# Altium schematic sheet AVD_eFuse_LV_Supply.SchDoc: GEM AVD eFuse
size 420 x 297 mm; Author: G.Kasprowicz; CompanyName: WUT ISE; DrawnBy: G.Kasprowicz; Organization: WUT ISE; Address1: PW ISE; Address2: Nowowiejska 15/19 00-665 Warsaw; Address3: gkasprow@gmail.com; Revision: 2; SheetNumber: 4; SheetTotal: 6; ModifiedBy: -; CheckedDate: -; Title2: LV supply; DivGrp: WUT ISE; Designer: G.Kasprowicz; ModifiedDate: -; ProjectName: Sensor Box
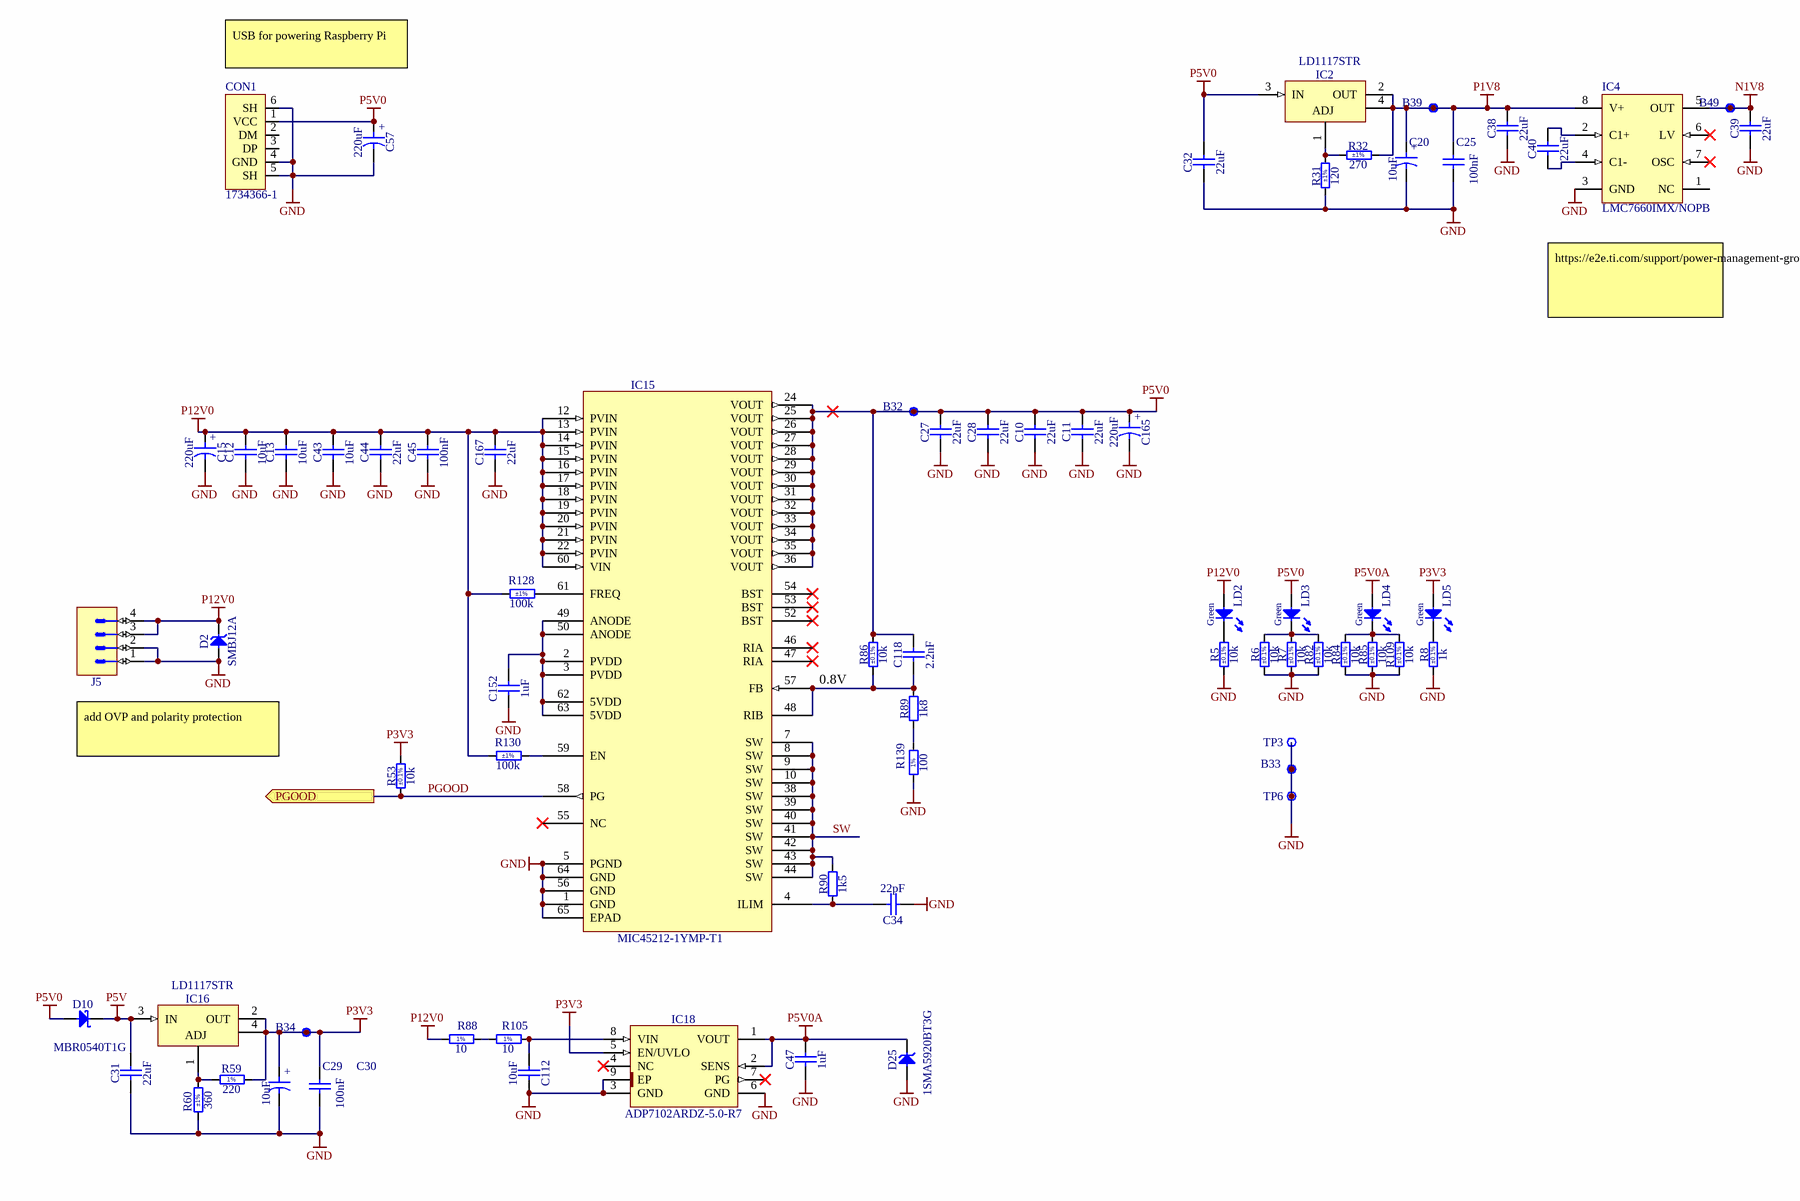
[diagram p0: AVD_eFuse_LV_Supply.SchDoc]

## Parts
B32  SMD Pad  [C100]  (value not drawn)
B33  SMD Pad  [C100]  (value not drawn)
B34  SMD Pad  [C100]  (value not drawn)
B39  SMD Pad  [C100]  (value not drawn)
B49  SMD Pad  [C100]  (value not drawn)
C10  22uF  [CAPC2012X135N]
C11  22uF  [CAPC2012X135N]
C12  10uF  [CAPC2012X135N]
C13  10uF  [CAPC2012X135N]
C15  220uF  [CAPMP7343X430N]
C20  10uF  [CAPAE430X540N]
C25  100nF  [CAPC1608X87N]
C27  22uF  [CAPC2012X135N]
C28  22uF  [CAPC2012X135N]
C29  10uF  [CAPAE430X540N]
C30  100nF  [CAPC1608X87N]
C31  22uF  [CAPC2012X135N]
C32  22uF  [CAPC2012X135N]
C34  22pF  [CAPC1005X55N]
C38  22uF  [CAPC2012X135N]
C39  22uF  [CAPC2012X135N]
C40  22uF  [CAPC2012X135N]
C43  10uF  [CAPC2012X135N]
C44  22uF  [CAPC2012X135N]
C45  100nF  [CAPC1608X87N]
C47  1uF  [CAPC1608X87N]
C57  220uF  [CAPMP7343X430N]
C112  10uF  [CAPC2012X135N]
C118  2.2nF  [CAPC1608X87N]
C152  1uF  [CAPC1608X87N]
C165  220uF  [CAPMP7343X430N]
C167  22uF  [CAPC2012X135N]
CON1  1734366-1  [1734366-1]
D2  SMBJ12A  [DIOM5336X265N]
D10  MBR0540T1G  [SOD3716X135N]
D25  1SMA5920BT3G  [DIOM5226X220N]
IC2  LD1117STR  [SOT230P700X180-4N]
IC4  LMC7660IMX/NOPB  [D0008A_L]
IC15  MIC45212-1YMP-T1  [MICROCHIP_QFN64_12X12]
IC16  LD1117STR  [SOT230P700X180-4N]
IC18  ADP7102ARDZ-5.0-R7  [SOIC127P600X175-9N-R241X309]
J5  Mini-Fit Jr.™  [MOLEX_39-30-0040]  (value not drawn)
LD2  Green  [LED_KINGBRIGHT_KP-1608CGCK]
LD3  Green  [LED_KINGBRIGHT_KP-1608CGCK]
LD4  Green  [LED_KINGBRIGHT_KP-1608CGCK]
LD5  Green  [LED_KINGBRIGHT_KP-1608CGCK]
R5  10k  Tolerance: ±0.1%  [RESC1608X64N]
R6  10k  Tolerance: ±0.1%  [RESC1608X64N]
R7  10k  Tolerance: ±0.1%  [RESC1608X64N]
R8  1k  Tolerance: ±0.1%  [RESC1608X55N]
R31  120  Tolerance: ±1%  [RESC1005X40N]
R32  270  Tolerance: ±1%  [RESC1005X40N]
R53  10k  Tolerance: ±0.1%  [RESC1608X64N]
R59  220  [RESC1005X40N]
R60  360  Tolerance: ±1%  [RESC1608X55N]
R82  10k  Tolerance: ±0.1%  [RESC1608X64N]
R84  10k  Tolerance: ±0.1%  [RESC1608X64N]
R85  10k  Tolerance: ±0.1%  [RESC1608X64N]
R86  10k  Tolerance: ±0.1%  [RESC1608X64N]
R88  10  [RESC2012X60N]
R89  1k8  [RESC1608X55N]
R90  1k5  [RESC1005X40N]
R105  10  [RESC2012X60N]
R109  10k  Tolerance: ±0.1%  [RESC1608X64N]
R128  100k  Tolerance: ±1%  [RESC1608X55N]
R130  100k  Tolerance: ±1%  [RESC1608X55N]
R139  100  [RESC1005X40N]
TP3  (no value)  [TYCO_RCT-0C]
TP6  (no value)  [TYCO_RCT-0C]

## Ports
PGOOD (out, see GEM_AVD_eFuse[2B], AVD_eFuse_HV_Ctrl[4E])

## Nets
GND: B33.1 C10.1 C11.1 C12.1 C13.1 C15.2 C20.2 C25.1 C27.1 C28.1 C29.2 C30.1 C31.1 C32.1 C34.1 C38.1 C39.1 C43.1 C44.1 C45.1 C47.1 C57.2 C112.2 C152.1 C165.2 C167.1 CON1.4(GND) CON1.5(SH) CON1.6(SH) D2.2(A) D25.2(A) IC4.3(GND) IC15.1(GND) IC15.5(PGND) IC15.56(GND) IC15.64(GND) IC15.65(EPAD) IC18.3(GND) IC18.6(GND) IC18.9(EP) J5.1 J5.2 R5.1 R6.1 R7.1 R8.1 R31.1 R60.1 R82.1 R84.1 R85.1 R109.1 R139.1 TP3.1 TP6.1
N1V8: B49.1 C39.2 IC4.5(OUT)
P1V8: B39.1 C20.1 C25.2 C38.2 IC2.2(OUT) IC2.4(OUT) IC4.8(V+) R32.2
P3V3: B34.1 C29.1 C30.2 IC16.2(OUT) IC16.4(OUT) IC18.5(EN/UVLO) LD5.2(A) R53.2 R59.2
P5V: C31.2 D10.1(C) IC16.3(IN)
P5V0: B32.1 C10.2 C11.2 C27.2 C28.2 C32.2 C57.1 C118.2 C165.1 CON1.1(VCC) D10.2(A) IC2.3(IN) IC15.24(VOUT) IC15.25(VOUT) IC15.26(VOUT) IC15.27(VOUT) IC15.28(VOUT) IC15.29(VOUT) IC15.30(VOUT) IC15.31(VOUT) IC15.32(VOUT) IC15.33(VOUT) IC15.34(VOUT) IC15.35(VOUT) IC15.36(VOUT) LD3.2(A) R86.2
P5V0A: C47.2 D25.1(C) IC18.1(VOUT) IC18.2(SENS) LD4.2(A)
P12V0: C12.2 C13.2 C15.1 C43.2 C44.2 C45.2 C167.2 D2.1(C) IC15.12(PVIN) IC15.13(PVIN) IC15.14(PVIN) IC15.15(PVIN) IC15.16(PVIN) IC15.17(PVIN) IC15.18(PVIN) IC15.19(PVIN) IC15.20(PVIN) IC15.21(PVIN) IC15.22(PVIN) IC15.60(VIN) J5.3 J5.4 LD2.2(A) R88.1 R128.1 R130.1
PGOOD: IC15.58(PG) R53.1 ; port PGOOD
SW: IC15.7(SW) IC15.8(SW) IC15.9(SW) IC15.10(SW) IC15.38(SW) IC15.39(SW) IC15.40(SW) IC15.41(SW) IC15.42(SW) IC15.43(SW) IC15.44(SW) R90.2
NetC34_2: C34.2 IC15.4(ILIM) R90.1
NetC40_1: C40.1 IC4.4(C1-)
NetC40_2: C40.2 IC4.2(C1+)
NetC112_1: C112.1 IC18.8(VIN) R105.2
NetC118_1: C118.1 IC15.48(RIB) IC15.57(FB) R86.1 R89.2
NetC152_2: C152.2 IC15.2(PVDD) IC15.3(PVDD) IC15.49(ANODE) IC15.50(ANODE) IC15.62(5VDD) IC15.63(5VDD)
NetIC2_1: IC2.1(ADJ) R31.2 R32.1
NetIC15_59: IC15.59(EN) R130.2
NetIC15_61: IC15.61(FREQ) R128.2
NetIC16_1: IC16.1(ADJ) R59.1 R60.2
NetLD2_1: LD2.1(C) R5.2
NetLD3_1: LD3.1(C) R6.2 R7.2 R82.2
NetLD4_1: LD4.1(C) R84.2 R85.2 R109.2
NetLD5_1: LD5.1(C) R8.2
NetR88_2: R88.2 R105.1
NetR89_1: R89.1 R139.2

Not connected (* = marked no-connect by the designer): CON1 2(DM) 3(DP); IC4 1(NC) 6(LV)* 7(OSC)*; IC15 46(RIA)* 47(RIA)* 52(BST)* 53(BST)* 54(BST)* 55(NC)*; IC18 4(NC)* 7(PG)*

## Notes on the sheet
- (near CON1) USB for powering Raspberry Pi
- https://e2e.ti.com/support/power-management-group/power-management/f/power-management-forum/934737/lmc7660-ceramic-capacitor?tisearch=e2e-sitesearch&keymatch=lmc7660#
- (near R86) 0.8V
- add OVP and polarity protection
- Project/Equipment
- Document
- Designer
- Drawn by
- Check.by
- Copyright WUT ISE 2020.
  This documentation describes Open Hardware and is licensed under the CERN OHL v.1.2. You may redistribute and modify this documentation under the terms of the CERN OHL v.1.2. (http://ohwr.org/CERNOHL). This documentation is distributed WITHOUT ANY EXPRESS OR IMPLIED WARRANTY, INCLUDING OF MERCHANTABILITY, SATISFACTORY QUALITY AND FITNESS FOR A PARTICULAR PURPOSE. Please see the CERN OHL v.1.2 for applicable conditions.
- Contact
- File
- Last Mod.
- Print Date
- Sheet
- Size
- A3
- of
- Rev
- (in symbol CAE430-540_10UF_16V_20%) +
- (in symbol CTE7343-43_220UF_16V_10%) +
- (in symbol R0402_100R_1%_0.0625W_100PPM) 1%
- (in symbol R0402_220R_1%_0.0625W_100PPM) 1%
- (in symbol R0805_10R_1%_0.125W_200PPM) 1%

## Library data of the parts
B32-B34 B39 B49 = SMD_PAD_D1MM: Pad; Part Description: 1mm Diameter SMD Pad; Mounted: No; Part Number: SMD_PAD_D1MM; Component Kind: Standard (No BOM); Component Type: Standard (No BOM); Pin Count: 1; Family: SMD Pad; Socket: No; SMD: Yes; Sense: No; Status: None; ComponentHeight: 0mm; HelpURL: Undefined; Author: CERN DEM JLC; CreateDate: 10.10.2017; LatestRevisionDate: 10.10.2017; PackageDescription: 1mm Diameter SMD Pad
C10 C11 C27 C28 C31 C32 C38-C40 C44 C167 = CC0805_22UF_16V_10%_X5R: Non-polarised capacitor; Part Description: SMD Multilayer Chip Ceramic Capacitor; Manufacturer: GENERIC; Manufacturer1 Part Number: C2012X5R1C226KT; Voltage: 16V; TC: X5R; Tolerance: ±10%; Part Number: CC0805_22UF_16V_10%_X5R; Component Kind: Standard; Component Type: Standard; Pin Count: 2; Value: 22uF; Status: Preferred; Manufacturer Part Number: CC0805_22UF_16V_10%_X5R; Case: 0805; Mounted: Yes; Socket: No; SMD: Yes; Sense: No; Manufacturer1 Example: TDK; Manufacturer1 ComponentHeight: 1.35mm; HelpURL: \\cern.ch\dfs\Applications\Altium\Datasheets\CC0805_X5R_TDK_C.pdf; Author: CERN DEM JLC; CreateDate: 25.10.2012; LatestRevisionDate: 25.10.2012
C12 C13 C43 C112 = CC0805_10UF_16V_10%_X5R: Non-polarised capacitor; Part Description: SMD Multilayer Chip Ceramic Capacitor; Manufacturer: GENERIC; Manufacturer1 Part Number: C0805C106K4PAC; Voltage: 16V; TC: X5R; Tolerance: ±10%; Part Number: CC0805_10UF_16V_10%_X5R; Component Kind: Standard; Component Type: Standard; Pin Count: 2; Value: 10uF; Status: Preferred; Manufacturer Part Number: CC0805_10UF_16V_10%_X5R; Case: 0805; Mounted: Yes; Socket: No; SMD: Yes; Manufacturer1 Example: KEMET; Manufacturer1 ComponentHeight: 1.4mm; HelpURL: \\cern.ch\dfs\Applications\Altium\Datasheets\CC1206_X5R_KEMET.pdf; Author: CERN DEM JLC; CreateDate: 03.12.2007; LatestRevisionDate: 03.12.2007; Sense: No
C15 C57 C165 = CTE7343-43_220UF_16V_10%: Polarised capacitor; Part Description: Solid Tantalum Chip Capacitor; Manufacturer: GENERIC; Manufacturer1 Part Number: TAJE227K016R; Voltage: 16V; Tolerance: ±10%; Part Number: CTE7343-43_220UF_16V_10%; Component Kind: Standard; Component Type: Standard; Pin Count: 2; Value: 220uF; Status: Preferred; Manufacturer Part Number: CTE7343-43_220UF_16V_10%; Case: E; Mounted: Yes; Socket: No; SMD: Yes; Sense: No; Manufacturer1 Example: AVX; Manufacturer1 ComponentHeight: 4.3mm; HelpURL: \\cern.ch\dfs\Applications\Altium\Datasheets\CTE_AVX_TAJ.pdf; Author: CERN DEM JLC; CreateDate: 03.12.2007; LatestRevisionDate: 03.12.2007
C20 C29 = CAE430-540_10UF_16V_20%: Polarised capacitor; Part Description: Aluminum Electrolytic SMT Capacitor; Manufacturer: PANASONIC; Manufacturer Part Number: EEEFK1C100AR; Voltage: 16V; Tolerance: ±20%; Part Number: CAE430-540_10UF_16V_20%; Component Kind: Standard; Component Type: Standard; Pin Count: 2; Value: 10uF; Status: Not Recommended; Case: B; Mounted: Yes; Socket: No; SMD: Yes; Sense: No; ComponentHeight: 5.8mm; HelpURL: \\cern.ch\dfs\Applications\Altium\Datasheets\CAE_PANASONIC_FK-V.pdf; Author: CERN DEM JLC; CreateDate: 03.12.2007; LatestRevisionDate: 05.11.2014
C25 C30 C45 = CC0603_100NF_50V_10%_X5R: Non-polarised capacitor; Part Description: SMD Multilayer Chip Ceramic Capacitor; Manufacturer: GENERIC; Manufacturer1 Part Number: C1608X5R1H104K080; Voltage: 50V; TC: X5R; Tolerance: ±10%; Part Number: CC0603_100NF_50V_10%_X5R; Component Kind: Standard; Component Type: Standard; Pin Count: 2; Value: 100nF; Status: None; Manufacturer Part Number: CC0603_100NF_50V_10%_X5R; Case: 0603; Mounted: Yes; Socket: No; SMD: Yes; Sense: No; Manufacturer1 Example: TDK; Manufacturer1 ComponentHeight: 0.9mm; HelpURL: \\cern.ch\dfs\Applications\Altium\Datasheets\CC0603_X5R_TDK_C.pdf; Author: CERN DEM MR; CreateDate: 08.01.2016; LatestRevisionDate: 08.01.2016
C34 = CC0402_22PF_50V_5%_C0G: Non-polarised capacitor; Part Description: SMD Multilayer Chip Ceramic Capacitor; Manufacturer: GENERIC; Manufacturer1 Part Number: C0402C220J5GACTU; Voltage: 50V; TC: C0G/NP0; Tolerance: ±5%; Part Number: CC0402_22PF_50V_5%_C0G; Component Kind: Standard; Component Type: Standard; Pin Count: 2; Value: 22pF; Status: Preferred; Manufacturer Part Number: CC0402_22PF_50V_5%_C0G; Case: 0402; Mounted: Yes; Socket: No; SMD: Yes; Sense: No; Manufacturer1 Example: KEMET; Manufacturer1 ComponentHeight: 0.55mm; HelpURL: \\cern.ch\dfs\Applications\Altium\Datasheets\CC0402_C0G_KEMET_(Commercial Grade).pdf; Author: CERN DEM JLC; CreateDate: 03.12.2007; LatestRevisionDate: 03.12.2007
C47 C152 = CC0603_1UF_25V_10%_X7R: Non-polarised capacitor; Part Description: SMD Multilayer Chip Ceramic Capacitor; Manufacturer: GENERIC; Manufacturer1 Part Number: GRM188R71E105KA12D; Voltage: 25V; TC: X7R; Tolerance: ±10%; Part Number: CC0603_1UF_25V_10%_X7R; Component Kind: Standard; Component Type: Standard; Pin Count: 2; Value: 1uF; Status: None; Manufacturer Part Number: CC0603_1UF_25V_10%_X7R; Case: 0603; Mounted: Yes; Socket: No; SMD: Yes; Sense: No; Manufacturer1 Example: MURATA; Manufacturer1 ComponentHeight: 0.9mm; HelpURL: \\cern.ch\dfs\Applications\Altium\Datasheets\CC0603_X7R_MURATA.pdf; Author: CERN DEM JLC; CreateDate: 18/01/2011; LatestRevisionDate: 18/01/2011
C118 = CC0603_2.2NF_50V_5%_C0G: Non-polarised capacitor; Part Description: SMD Multilayer Chip Ceramic Capacitor; Manufacturer: GENERIC; Manufacturer1 Part Number: C1608C0G1H222J080AA; Voltage: 50V; TC: C0G/NP0; Tolerance: ±5%; Part Number: CC0603_2.2NF_50V_5%_C0G; Component Kind: Standard; Component Type: Standard; Pin Count: 2; Value: 2.2nF; Status: Preferred; Manufacturer Part Number: CC0603_2.2NF_50V_5%_C0G; Case: 0603; Mounted: Yes; Socket: No; SMD: Yes; Sense: No; Manufacturer1 Example: TDK; Manufacturer1 ComponentHeight: 0.9mm; HelpURL: \\cern.ch\dfs\Applications\Altium\Datasheets\CC0603_C0G_TDK_C.pdf; Author: CERN DEM JMW; CreateDate: 23.06.2014; LatestRevisionDate: 23.06.2014
CON1 = CON_USB_A_Vertical: USB connector A type; Manufacturer Part Number: 1734366-1
D2 = SMBJ12A: Zener Diode; Part Description: Uni-Directional Transient Voltage Suppressor Diode; Manufacturer: FAIRCHILD SEMICONDUCTOR; Voltage: 12V; Power: 600W; PressFit: No; Bonding: No; Part Number: SMBJ12A; Component Kind: Standard; Component Type: Standard; Device: SMBJ12A; PackageDescription: DO-214-AA/SMB Diode, Molded Body; 5.34mm L X 3.625mm W X 2.65mm H, IPC Medium Density; Manufacturer Part Number: SMBJ12A; Pin Count: 2; Case: DO-214AA; Mounted: Yes; Socket: No; SMD: Yes; Sense: No; ComponentHeight: 2.65mm; HelpURL: \\cern.ch\dfs\Applications\Altium\Datasheets\SMBJ.pdf; Author: CERN DEM JLC; CreateDate: 10.04.2013; LatestRevisionDate: 10.04.2013
D10 = MBR0540T1G: Schottky Diode; Part Description: Schottky Power Rectifier; Manufacturer: ON SEMICONDUCTOR; Voltage: 40V; Power: 500mA; PressFit: No; Bonding: No; Part Number: MBR0540T1G; Component Kind: Standard; Component Type: Standard; Device: MBR0540T1G; PackageDescription: Diode (SOD-123), 2.70mm W X 1.60mm L X 1.35mm H body, IPC Medium Density; Manufacturer Part Number: MBR0540; Pin Count: 2; Case: SOD-123; Mounted: Yes; Socket: No; SMD: Yes; Sense: No; ComponentHeight: 1.35mm; HelpURL: \\cern.ch\dfs\Applications\Altium\Datasheets\MBR0540T1G.pdf; Author: CERN DEM JLC; CreateDate: 11.04.2011; LatestRevisionDate: 24.05.2022
D25 = D_Zener_1SMA5920BT3G: 6.2V 1.5 Watt Plastic Surface Mount Zener Voltage Regulators; Manufacturer: ON SEMICONDUCTOR; Power: 1.5W; PressFit: No; Bonding: No; Part Number: 1SMA5920BT3G; Component Kind: Standard; Component Type: Standard; Device: 1SMA5920BT3G; PackageDescription: DO-214-AC/SMA Diode, Molded Body; 5.21mm L X 2.60mm W X 2.20mm H, IPC Medium Density; Voltage: 6.2V; Part Description: Zener Voltage Regulators; Manufacturer Part Number: 1SMA5920BT3G; Pin Count: 2; Case: DO-214AC; Mounted: Yes; Socket: No; SMD: Yes; Sense: No; ComponentHeight: 2.20mm; HelpURL: \\cern.ch\dfs\Applications\Altium\Datasheets\1SMA5913BT3G.pdf; Author: GK; CreateDate: 16/02/2018; LatestRevisionDate: 16/02/2018
IC2 IC16 = LD1117STR: 3-Terminal Regulator 1=Adj 2=OUT 3=IN 4=OUT; Part Description: 1.25V To 15V Adjustable, 800mA Low-Dropout Positive Voltage Regulator; Manufacturer: ST MICROELECTRONICS; PressFit: No; Bonding: No; Part Number: LD1117STR; Component Kind: Standard; Component Type: Standard; Device: LD1117STR; PackageDescription: SOT223, 2.30mm Pitch; 4 Pin, 3.70mm W X 6.70mm L X 1.80mm H body, IPC Medium Density; Manufacturer Part Number: LD1117STR; Pin Count: 4; Case: SOT223; Mounted: Yes; Socket: No; SMD: Yes; Sense: No; ComponentHeight: 1.8mm; HelpURL: \\cern.ch\dfs\Applications\Altium\Datasheets\LD1117STR.pdf; Author: CERN DEM MR; CreateDate: 14.07.2016; LatestRevisionDate: 14.07.2016
IC4 = CMP-0065-00034-3: Switched Capacitor Voltage Converter, 8-pin Narrow SOIC, Pb-Free; Manufacturer: Texas Instruments; PowerWise: N; CompType: Switch Caps; PackageTopMarking: NSZXTT*LMC76*60IM; Code_IPC: SOIC127P600-8; Code_JEDEC: MS-012-AA; PackageReference: D0008A; RoHS: Y; ComponentLink1URL: http://www.ti.com/general/docs/lit/getliterature.tsp?genericPartNumber=LMC7660&fileType=pdf; PinCount: 8; PackageDescription: SOIC Narrow, 4.9 x 3.9 x 1.45mm, 8 Lead, 1.27mm Pitch; ComponentLink1Description: Datasheet URL; Manufacturer Part Number: LMC7660IMX/NOPB
IC15 = PM_MIC45212-1: 0.8V to 85% PVIN (4.5...26V), 14A Synchronous Step-Down Regulator Module; Manufacturer: MICROCHIP TECHNOLOGY; PressFit: No; Bonding: No; Part Number: MIC45212-1YMP-T1; Component Kind: Standard; Component Type: Standard; Device: MIC45212-1YMP-T1; PackageDescription: MICROCHIP_QFN64_12X12; Part Description: 0.8V to 85% PVIN (4.5...26V), 14A Synchronous Step-Down Regulator Module; Manufacturer Part Number: MIC45212-1YMP-T1; Pin Count: 64; Mounted: Yes; Socket: No; SMD: Yes; Sense: No; ComponentHeight: 3mm; HelpURL: \\cern.ch\dfs\Applications\Altium\Datasheets\MIC45116-1YMP.pdf; Author: GK; CreateDate: 15.08.2016; LatestRevisionDate: 15.08.2016
IC18 = ADP7102ARDZ-5.0-R7: 300 mA, Low Noise, CMOS LDO Linear Regulator; Part Description: 5V, 300mA, Low Noise, CMOS LDO Linear Regulator; Manufacturer: ANALOG DEVICES; PressFit: No; Bonding: No; Part Number: ADP7102ARDZ-5.0-R7; Component Kind: Standard; Component Type: Standard; Device: ADP7102ARDZ-5.0-R7; PackageDescription: SOIC 8, Pitch 1.27mm - Body 3.9x4.9mm, (w/thermal tab 2.41mm X 3.098mm), IPC Medium Density; Manufacturer Part Number: ADP7102ARDZ-5.0-R7; Pin Count: 8; Case: SOIC8; Mounted: Yes; Socket: No; SMD: Yes; Sense: No; ComponentHeight: 1.75mm; HelpURL: \\cern.ch\dfs\Applications\Altium\Datasheets\ADP7102ARDZ-5.0-R7.pdf; Author: CERN DEM JLC; CreateDate: 17.03.2014; LatestRevisionDate: 17.03.2014
J5 = MOLEX_39-30-0040: Connector 4 Male; Part Description: 4.20mm (.165") Pitch Mini-Fit Jr. Header, Dual Row, Right Angle with Snap-in Plastic Peg PCB Lock, 4 Circuits; Manufacturer: MOLEX; PressFit: No; Part Number: MOLEX_39-30-0040; Component Kind: Standard; Component Type: Standard; Pin Count: 4; Family: Mini-Fit Jr.™; Mounted: Yes; Socket: No; SMD: No; Sense: No; Status: None; Manufacturer Part Number: 39-30-0040; ComponentHeight: 11.4mm; HelpURL: \\cern.ch\dfs\Applications\Altium\Datasheets\MOLEX_39-30-0040.pdf; Author: CERN DEM JLC; CreateDate: 02/10/2018; LatestRevisionDate: 02/10/2018
LD2-LD5 = LED_KINGBRIGHT_KP-1608CGCK: LED Green 1C 2A; Part Description: 1.6x0.8mm SMD Chip Green LED Lamp; PressFit: No; Bonding: No; Part Number: LED_KINGBRIGHT_KP-1608CGCK; Component Kind: Standard; Component Type: Standard; Color: Green; PackageDescription: SMT Green LED, Case 0603, Body L 1.60mm x W 0.80mm x H 1.10mm; Manufacturer: KINGBRIGHT; Manufacturer Part Number: KP-1608CGCK; Pin Count: 2; Case: 0603; Mounted: Yes; Socket: No; SMD: Yes; Sense: No; ComponentHeight: 1.1mm; HelpURL: \\cern.ch\dfs\Applications\Altium\Datasheets\LED_KINGBRIGHT_KP-1608CGCK.pdf; Author: CERN DEM HF; CreateDate: 01.10.2021; LatestRevisionDate: 01.10.2021
R5-R7 R53 R82 R84-R86 R109 = R0603_10K_0.1%_0.1W_25PPM: Resistor - 0.1%; Part Description: Thin Film Chip Resistor; Manufacturer: GENERIC; Manufacturer1 Part Number: ERA3AEB103V; Power: 0.1W; TC: ±25ppm/°C; PressFit: No; Part Number: R0603_10K_0.1%_0.1W_25PPM; Component Kind: Standard; Component Type: Standard; Pin Count: 2; Value: 10k; Status: Not Recommended; Manufacturer Part Number: R0603_10K_0.1%_0.1W_25PPM; Case: 0603; Mounted: Yes; Sense: No; Socket: No; SMD: Yes; Manufacturer1 Example: PANASONIC; Manufacturer1 ComponentHeight: 0.55mm; HelpURL: \\cern.ch\dfs\Applications\Altium\Datasheets\R0603_PANASONIC_ERA.pdf; Author: CERN DEM JMW; CreateDate: 09.11.2015; LatestRevisionDate: 11.01.2017
R8 = R0603_1K_0.1%_0.063W_10PPM: Resistor - 0.1%; Part Description: Thin Film Chip Resistor; Manufacturer: GENERIC; Manufacturer1 Part Number: RN73C1J1K0BTG; Power: 0.063W; TC: ±10ppm; PressFit: No; Part Number: R0603_1K_0.1%_0.063W_10PPM; Component Kind: Standard; Component Type: Standard; Pin Count: 2; Value: 1k; Status: Not Recommended; Manufacturer Part Number: R0603_1K_0.1%_0.063W_10PPM; Case: 0603; Mounted: Yes; Sense: No; Socket: No; SMD: Yes; Manufacturer1 Example: TYCO HOLSWORTHY; Manufacturer1 ComponentHeight: 0.55mm; HelpURL: \\cern.ch\dfs\Applications\Altium\Datasheets\R0603_Tyco_RN73.pdf; Author: CERN DEM BC; CreateDate: 23.05.2016; LatestRevisionDate: 23.05.2016
R31 = R0402_120R_1%_0.0625W_100PPM: Resistor - 1%; Part Description: General Purpose Thick Film Chip Resistor; Manufacturer: GENERIC; Manufacturer1 Part Number: 232270671201L; TC: ±100ppm/°C; PressFit: No; Part Number: R0402_120R_1%_0.0625W_100PPM; Component Kind: Standard; Component Type: Standard; Pin Count: 2; Value: 120; Status: Not Recommended; Power: 0.0625W; Manufacturer Part Number: R0402_120R_1%_0.0625W_100PPM; Case: 0402; Mounted: Yes; Sense: No; Socket: No; SMD: Yes; Manufacturer1 Example: YAGEO PHYCOMP; Manufacturer1 ComponentHeight: 0.4mm; HelpURL: \\cern.ch\dfs\Applications\Altium\Datasheets\R0402_Phycomp_RC0402.pdf; Author: CERN DEM JLC; CreateDate: 03.12.2007; LatestRevisionDate: 17.10.2012
R32 = R0402_270R_1%_0.0625W_100PPM: Resistor - 1%; Part Description: General Purpose Thick Film Chip Resistor; Manufacturer: GENERIC; Manufacturer1 Part Number: 232270672701L; TC: ±100ppm/°C; PressFit: No; Part Number: R0402_270R_1%_0.0625W_100PPM; Component Kind: Standard; Component Type: Standard; Pin Count: 2; Value: 270; Status: Not Recommended; Power: 0.0625W; Manufacturer Part Number: R0402_270R_1%_0.0625W_100PPM; Case: 0402; Mounted: Yes; Sense: No; Socket: No; SMD: Yes; Manufacturer1 Example: YAGEO PHYCOMP; Manufacturer1 ComponentHeight: 0.4mm; HelpURL: \\cern.ch\dfs\Applications\Altium\Datasheets\R0402_Phycomp_RC0402.pdf; Author: CERN DEM JLC; CreateDate: 03.12.2007; LatestRevisionDate: 17.10.2012
R59 = R0402_220R_1%_0.0625W_100PPM: Resistor - 1%; Part Description: General Purpose Thick Film Chip Resistor; Manufacturer: GENERIC; Manufacturer1 Part Number: 232270672201L; TC: ±100ppm/°C; PressFit: No; Part Number: R0402_220R_1%_0.0625W_100PPM; Component Kind: Standard; Component Type: Standard; Pin Count: 2; Value: 220; Status: Not Recommended; Power: 0.0625W; Tolerance: ±1%; Manufacturer Part Number: R0402_220R_1%_0.0625W_100PPM; Case: 0402; Mounted: Yes; Sense: No; Socket: No; SMD: Yes; Manufacturer1 Example: YAGEO PHYCOMP; Manufacturer1 ComponentHeight: 0.4mm; HelpURL: \\cern.ch\dfs\Applications\Altium\Datasheets\R0402_Phycomp_RC0402.pdf; Author: CERN DEM JLC; CreateDate: 03.12.2007; LatestRevisionDate: 17.10.2012
R60 = R0603_360R_1%_0.1W_100PPM: Resistor - 1%; Part Description: General Purpose Thick Film Chip Resistor; Manufacturer: GENERIC; Manufacturer1 Part Number: NRC06F3600TRF; Power: 0.1W; TC: ±100ppm/°C; PressFit: No; Part Number: R0603_360R_1%_0.1W_100PPM; Component Kind: Standard; Component Type: Standard; Pin Count: 2; Value: 360; Status: Preferred; Manufacturer Part Number: R0603_360R_1%_0.1W_100PPM; Case: 0603; Mounted: Yes; Sense: No; Socket: No; SMD: Yes; Manufacturer1 Example: NIC COMPONENT; Manufacturer1 ComponentHeight: 0.55mm; HelpURL: \\cern.ch\dfs\Applications\Altium\Datasheets\R0603_NIC_NRC.pdf; Author: CERN DEM JLC; CreateDate: 03.12.2007; LatestRevisionDate: 13.03.2008
R88 R105 = R0805_10R_1%_0.125W_200PPM: Resistor - 1%; Part Description: General Purpose Thick Film Chip Resistor; Manufacturer: GENERIC; Manufacturer1 Part Number: NRC10F10R0TRF; Power: 0.125W; TC: ±200ppm/°C; PressFit: No; Part Number: R0805_10R_1%_0.125W_200PPM; Component Kind: Standard; Component Type: Standard; Pin Count: 2; Value: 10; Status: Preferred; Tolerance: ±1%; Manufacturer Part Number: R0805_10R_1%_0.125W_200PPM; Case: 0805; Mounted: Yes; Sense: No; Socket: No; SMD: Yes; Manufacturer1 Example: NIC COMPONENT; Manufacturer1 ComponentHeight: 0.6mm; HelpURL: \\cern.ch\dfs\Applications\Altium\Datasheets\R0805_NIC_NRC.pdf; Author: CERN DEM JLC; CreateDate: 03.12.2007; LatestRevisionDate: 24.06.2009
R89 = R0603_1K8_1%_0.1W_100PPM: Resistor - 1%; Part Description: General Purpose Thick Film Chip Resistor; Manufacturer: GENERIC; Manufacturer1 Part Number: NRC06F1801TRF; Power: 0.1W; TC: ±100ppm/°C; PressFit: No; Part Number: R0603_1K8_1%_0.1W_100PPM; Component Kind: Standard; Component Type: Standard; Pin Count: 2; Value: 1k8; Status: Preferred; Tolerance: ±1%; Manufacturer Part Number: R0603_1K8_1%_0.1W_100PPM; Case: 0603; Mounted: Yes; Sense: No; Socket: No; SMD: Yes; Manufacturer1 Example: NIC COMPONENT; Manufacturer1 ComponentHeight: 0.55mm; HelpURL: \\cern.ch\dfs\Applications\Altium\Datasheets\R0603_NIC_NRC.pdf; Author: CERN DEM JLC; CreateDate: 03.12.2007; LatestRevisionDate: 13.03.2008
R90 = R0402_1K5_1%_0.0625W_100PPM: Resistor - 1%; Part Description: General Purpose Thick Film Chip Resistor; Manufacturer: GENERIC; Manufacturer1 Part Number: 232270671502L; TC: ±100ppm/°C; PressFit: No; Part Number: R0402_1K5_1%_0.0625W_100PPM; Component Kind: Standard; Component Type: Standard; Pin Count: 2; Value: 1k5; Status: Not Recommended; Power: 0.0625W; Tolerance: ±1%; Manufacturer Part Number: R0402_1K5_1%_0.0625W_100PPM; Case: 0402; Mounted: Yes; Sense: No; Socket: No; SMD: Yes; Manufacturer1 Example: YAGEO PHYCOMP; Manufacturer1 ComponentHeight: 0.4mm; HelpURL: \\cern.ch\dfs\Applications\Altium\Datasheets\R0402_Phycomp_RC0402.pdf; Author: CERN DEM JLC; CreateDate: 03.12.2007; LatestRevisionDate: 17.10.2012
R128 R130 = R0603_100K_1%_0.1W_100PPM: Resistor - 1%; Part Description: General Purpose Thick Film Chip Resistor; Manufacturer: GENERIC; Manufacturer1 Part Number: NRC06F1003TRF; Power: 0.1W; TC: ±100ppm/°C; PressFit: No; Part Number: R0603_100K_1%_0.1W_100PPM; Component Kind: Standard; Component Type: Standard; Pin Count: 2; Value: 100k; Status: Preferred; Manufacturer Part Number: R0603_100K_1%_0.1W_100PPM; Case: 0603; Mounted: Yes; Sense: No; Socket: No; SMD: Yes; Manufacturer1 Example: NIC COMPONENT; Manufacturer1 ComponentHeight: 0.55mm; HelpURL: \\cern.ch\dfs\Applications\Altium\Datasheets\R0603_NIC_NRC.pdf; Author: CERN DEM JLC; CreateDate: 03.12.2007; LatestRevisionDate: 13.03.2008
R139 = R0402_100R_1%_0.0625W_100PPM: Resistor - 1%; Part Description: General Purpose Thick Film Chip Resistor; Manufacturer: GENERIC; Manufacturer1 Part Number: 232270671001L; TC: ±100ppm/°C; PressFit: No; Part Number: R0402_100R_1%_0.0625W_100PPM; Component Kind: Standard; Component Type: Standard; Pin Count: 2; Value: 100; Status: Not Recommended; Power: 0.0625W; Tolerance: ±1%; Manufacturer Part Number: R0402_100R_1%_0.0625W_100PPM; Case: 0402; Mounted: Yes; Sense: No; Socket: No; SMD: Yes; Manufacturer1 Example: YAGEO PHYCOMP; Manufacturer1 ComponentHeight: 0.4mm; HelpURL: \\cern.ch\dfs\Applications\Altium\Datasheets\R0402_Phycomp_RC0402.pdf; Author: CERN DEM JLC; CreateDate: 03.12.2007; LatestRevisionDate: 17.10.2012
TP3 TP6 = TYCO_RCT-0C: Test Point; Part Description: 0805 (2012) Surface Mount Test Point; Manufacturer: TYCO ELECTRONICS; Manufacturer Part Number: RCT-0C; PressFit: No; Part Number: TYCO_RCT-0C; Component Kind: Standard; Component Type: Standard; Pin Count: 1; Mounted: Yes; Socket: No; SMD: Yes; Sense: No; Status: None; ComponentHeight: 1.45mm; HelpURL: \\cern.ch\dfs\Applications\Altium\Datasheets\TYCO_RCT-0C.pdf; Author: CERN DEM JLC; CreateDate: 07.05.2014; LatestRevisionDate: 07.05.2014